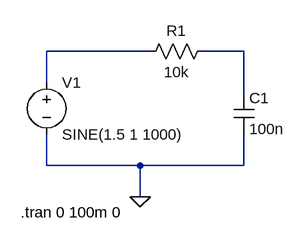
[diagram p0: schematic Draft1.asc]
Draft1.asc, the LTspice schematic file:
Version 4.1
SHEET 1 880 680
WIRE 224 80 64 80
WIRE 368 80 304 80
WIRE 64 128 64 80
WIRE 368 144 368 80
WIRE 64 256 64 208
WIRE 208 256 64 256
WIRE 368 256 368 208
WIRE 368 256 208 256
WIRE 208 304 208 256
FLAG 208 304 0
SYMBOL voltage 64 112 R0
WINDOW 123 0 0 Left 0
WINDOW 39 0 0 Left 0
SYMATTR InstName V1
SYMATTR Value SINE(1.5 1 1000)
SYMBOL res 320 64 R90
WINDOW 0 0 56 VBottom 2
WINDOW 3 32 56 VTop 2
SYMATTR InstName R1
SYMATTR Value 10k
SYMBOL cap 352 144 R0
SYMATTR InstName C1
SYMATTR Value 100n
TEXT 24 328 Left 2 !.tran 0 100m 0

The netlist it stands for:
* Draft1.asc
V1 N001 0 SINE(1.5 1 1000)
R1 N002 N001 10k
C1 N002 0 100n
.tran 0 100m 0
.backanno
.end